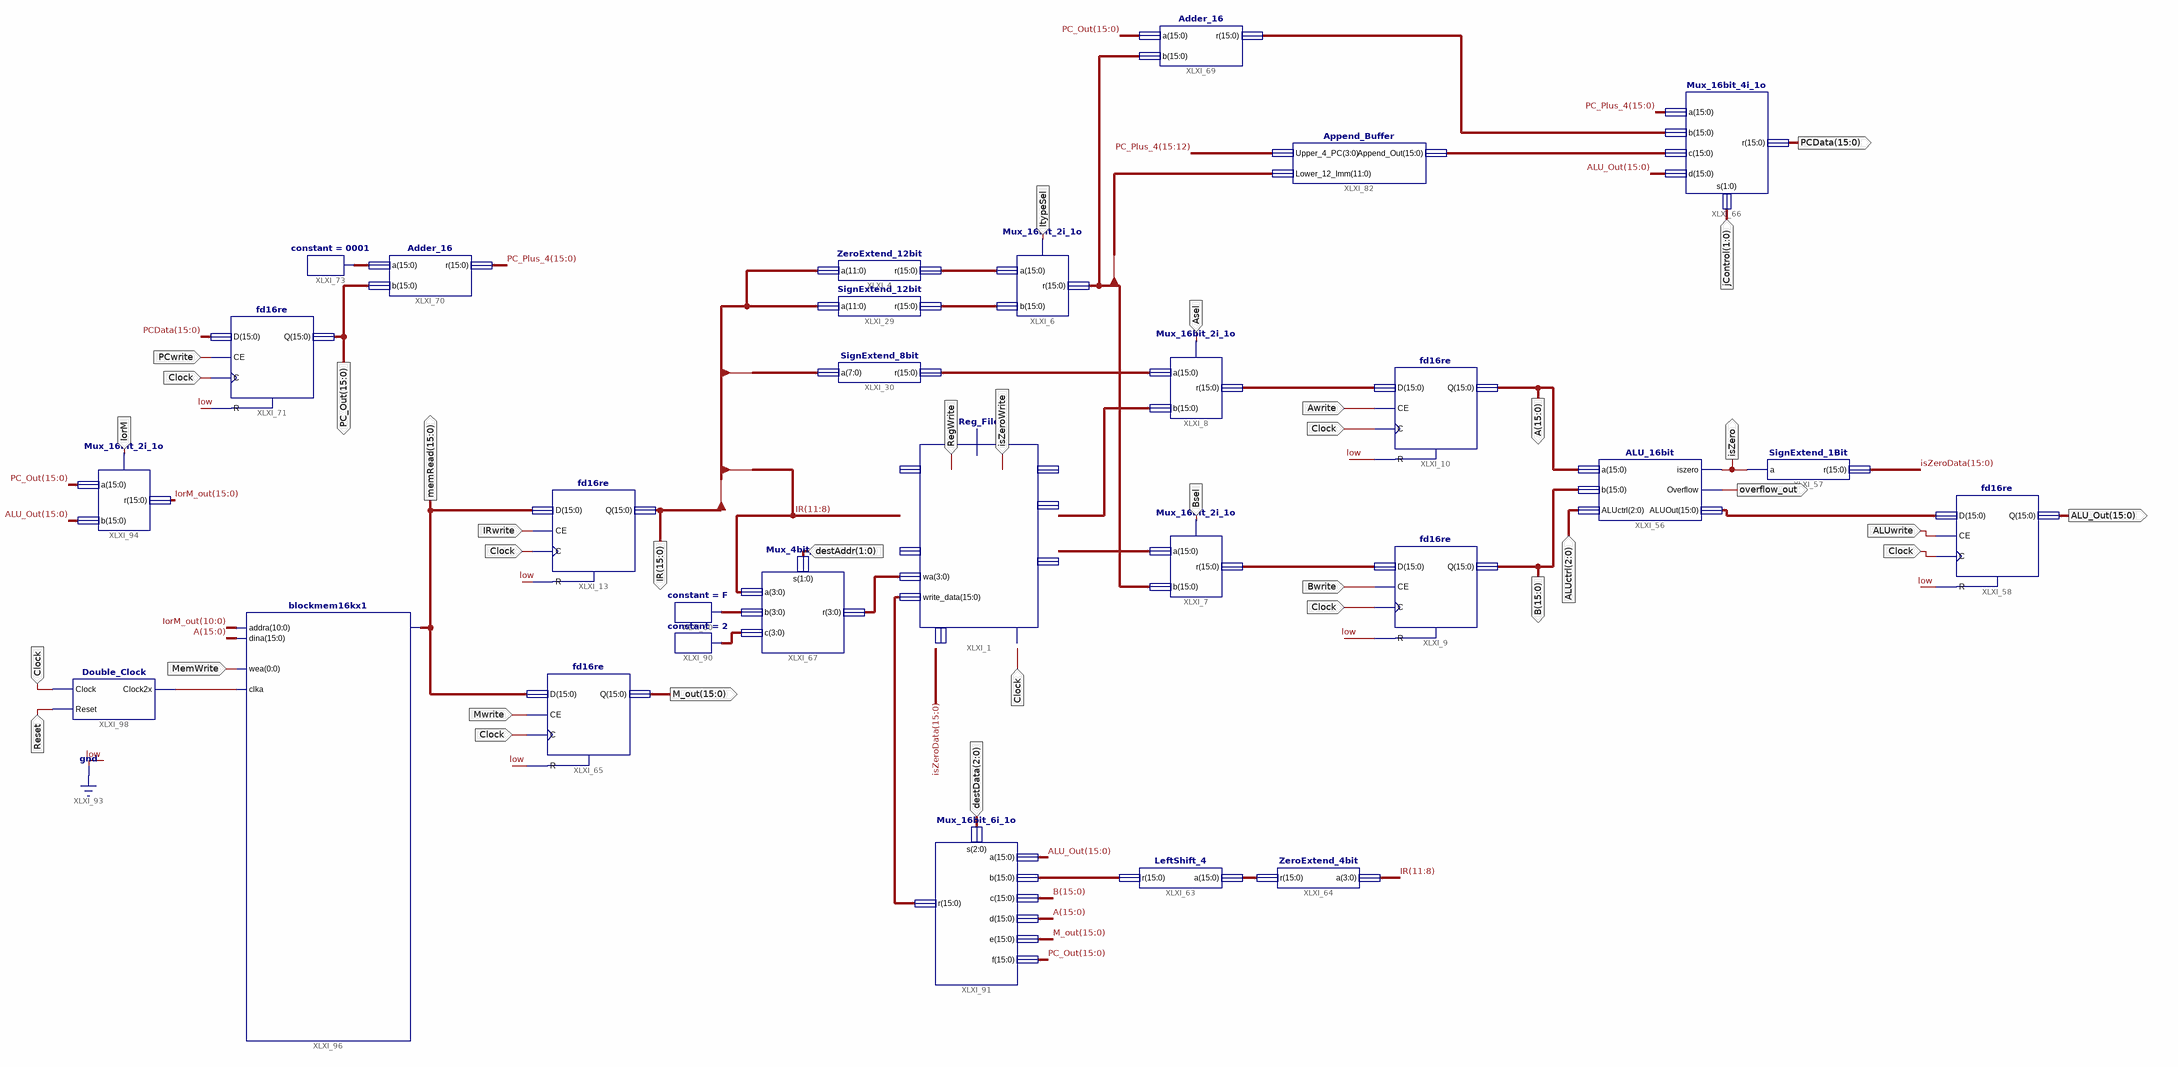
[diagram p0: schematic sheet 1]
// Xilinx ISE schematic Processor_Integration_6.sch (spartan3e) as structural Verilog: 29 symbols, 29 ports
module Processor_Integration_6 (
  input  RegWrite,
  input  isZeroWrite,
  input  IRwrite,
  input  Clock,
  input  ItypeSel,
  input  Bsel,
  input  Asel,
  input  Bwrite,
  input  Awrite,
  input  [2:0] ALUctrl,
  input  Mwrite,
  input  ALUwrite,
  input  [1:0] jControl,
  input  PCwrite,
  input  [1:0] destAddr,
  input  [2:0] destData,
  input  IorM,
  input  MemWrite,
  input  Reset,
  output [15:0] B,
  output [15:0] A,
  output isZero,
  output overflow_out,
  output [15:0] IR,
  output [15:0] M_out,
  output [15:0] PCData,
  output [15:0] PC_Out,
  output [15:0] memRead,
  output [15:0] ALU_Out
);

  wire XLXN_221;
  wire [3:0] write_address, XLXN_147, XLXN_169;
  wire [15:0] ALU_output, append, IorM_out, isZeroData, PC_Plus_4, r_out, write_Data, XLXN_12, XLXN_56,
       XLXN_98, XLXN_101, XLXN_130, XLXN_131, XLXN_152, XLXN_156, XLXN_177, XLXN_188, XLXN_215;

  Reg_File XLXI_1 (
    .write_data(write_Data), .reg_write(RegWrite), .iszero_write(isZeroWrite), .acc_data(XLXN_215),
    .ra(IR[11:8]), .read_data(XLXN_98), .wa(write_address), .iszero_data(isZeroData), .clock(Clock));  // open: in_data_write, out_data, in_data
  SignExtend_12bit XLXI_29 (.a(IR[11:0]), .r(XLXN_12));
  ZeroExtend_12bit XLXI_4 (.a(IR[11:0]), .r(XLXN_56));
  SignExtend_8bit XLXI_30 (.a(IR[7:0]), .r(XLXN_101));
  Mux_16bit_2i_1o XLXI_6 (.b(XLXN_12), .r(r_out), .s(ItypeSel), .a(XLXN_56));
  Mux_16bit_2i_1o XLXI_7 (.b(r_out), .r(XLXN_131), .s(Bsel), .a(XLXN_98));
  Mux_16bit_2i_1o XLXI_8 (.b(XLXN_215), .r(XLXN_130), .s(Asel), .a(XLXN_101));
  fd16re XLXI_9 (.C(Clock), .CE(Bwrite), .D(XLXN_131), .R(1'b0), .Q(B));
  fd16re XLXI_10 (.C(Clock), .CE(Awrite), .D(XLXN_130), .R(1'b0), .Q(A));
  ALU_16bit XLXI_56 (.a(A), .b(B), .ALUctrl(ALUctrl), .iszero(isZero), .Overflow(overflow_out), .ALUOut(ALU_output));
  SignExtend_1Bit XLXI_57 (.a(isZero), .r(isZeroData));
  fd16re XLXI_13 (.C(Clock), .CE(IRwrite), .D(memRead), .R(1'b0), .Q(IR));
  LeftShift_4 XLXI_63 (.a(XLXN_156), .r(XLXN_152));
  ZeroExtend_4bit XLXI_64 (.a(IR[11:8]), .r(XLXN_156));
  fd16re XLXI_65 (.C(Clock), .CE(Mwrite), .D(memRead), .R(1'b0), .Q(M_out));
  fd16re XLXI_58 (.C(Clock), .CE(ALUwrite), .D(ALU_output), .R(1'b0), .Q(ALU_Out));
  Mux_16bit_4i_1o XLXI_66 (.a(PC_Plus_4), .b(XLXN_177), .c(append), .d(ALU_Out), .r(PCData), .s(jControl));
  Adder_16 XLXI_69 (.a(PC_Out), .b(r_out), .r(XLXN_177));
  fd16re XLXI_71 (.C(Clock), .CE(PCwrite), .D(PCData), .R(1'b0), .Q(PC_Out));
  Adder_16 XLXI_70 (.a(XLXN_188), .b(PC_Out), .r(PC_Plus_4));
  constant #(.CValue("0001")) XLXI_73 (.O(XLXN_188));
  Append_Buffer XLXI_82 (.Upper_4_PC(PC_Plus_4[15:12]), .Lower_12_Imm(r_out[11:0]), .Append_Out(append));
  Mux_4bit_3i_1o XLXI_67 (.s(destAddr), .r(write_address), .a(IR[11:8]), .b(XLXN_147), .c(XLXN_169));
  constant #(.CValue("F")) XLXI_60 (.O(XLXN_147));
  constant #(.CValue("2")) XLXI_90 (.O(XLXN_169));
  Mux_16bit_6i_1o XLXI_91 (
    .s(destData), .r(write_Data), .a(ALU_Out), .b(XLXN_152), .c(B), .d(A), .e(M_out), .f(PC_Out));
  Mux_16bit_2i_1o XLXI_94 (.b(ALU_Out), .r(IorM_out), .s(IorM), .a(PC_Out));
  Double_Clock XLXI_98 (.Clock(Clock), .Reset(Reset), .Clock2x(XLXN_221));
  blockmem16kx1 XLXI_96 (.addra(IorM_out[10:0]), .dina(A), .wea(MemWrite), .clka(XLXN_221));  // open: douta
endmodule
